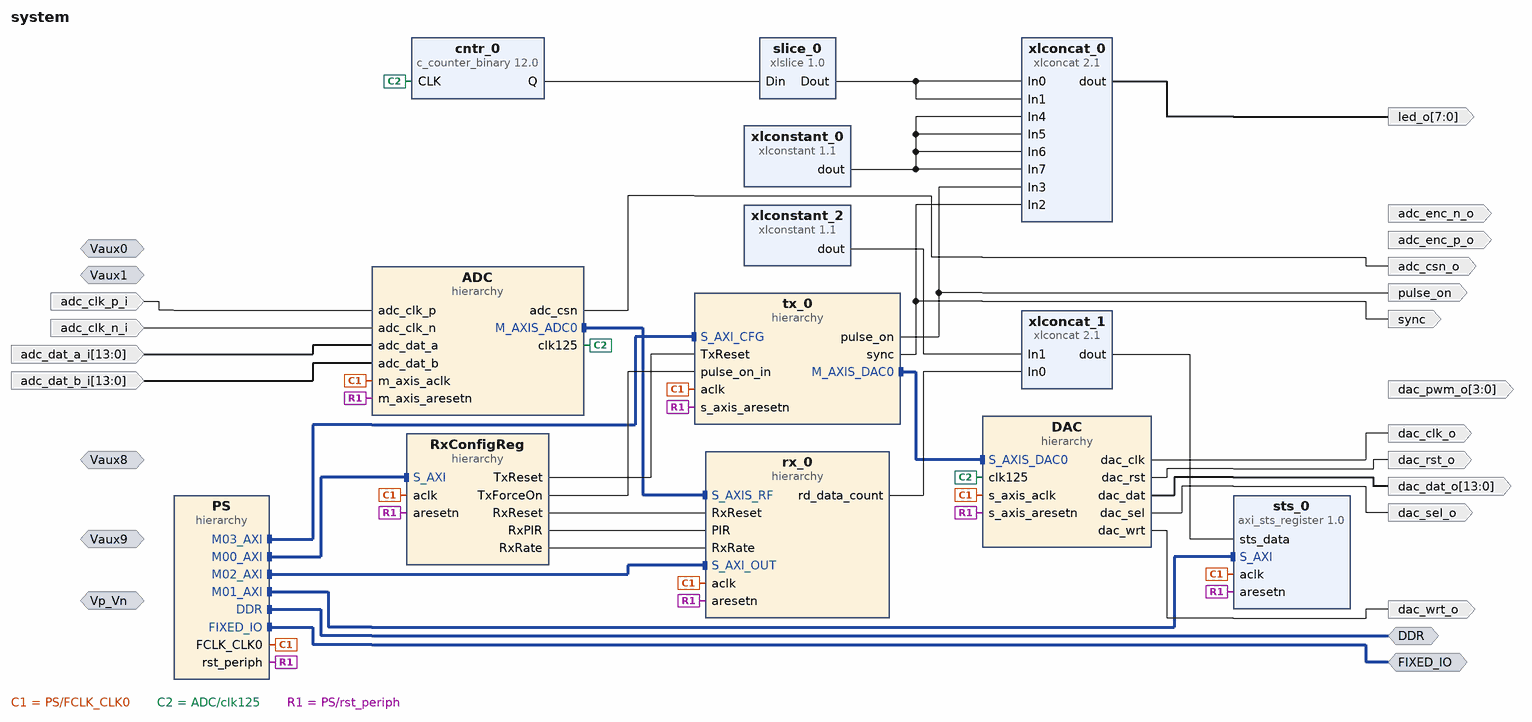
[diagram p0: block diagram of the top level]
# Vivado block design system, xc7z010clg400-1, Vivado 2016.3
create_bd_design system

create_bd_intf_port -mode Master -vlnv xilinx.com:interface:ddrx_rtl:1.0 DDR
create_bd_intf_port -mode Master -vlnv xilinx.com:display_processing_system7:fixedio_rtl:1.0 FIXED_IO
create_bd_intf_port -mode Slave -vlnv xilinx.com:interface:diff_analog_io_rtl:1.0 Vp_Vn
create_bd_intf_port -mode Slave -vlnv xilinx.com:interface:diff_analog_io_rtl:1.0 Vaux0
create_bd_intf_port -mode Slave -vlnv xilinx.com:interface:diff_analog_io_rtl:1.0 Vaux1
create_bd_intf_port -mode Slave -vlnv xilinx.com:interface:diff_analog_io_rtl:1.0 Vaux9
create_bd_intf_port -mode Slave -vlnv xilinx.com:interface:diff_analog_io_rtl:1.0 Vaux8
create_bd_port -dir O adc_enc_p_o
create_bd_port -dir O adc_enc_n_o
create_bd_port -dir O -from 3 -to 0 dac_pwm_o
create_bd_port -dir I adc_clk_p_i
create_bd_port -dir I adc_clk_n_i
create_bd_port -dir I -from 13 -to 0 adc_dat_a_i
create_bd_port -dir I -from 13 -to 0 adc_dat_b_i
create_bd_port -dir O adc_csn_o
create_bd_port -dir O dac_clk_o
create_bd_port -dir O dac_rst_o
create_bd_port -dir O dac_sel_o
create_bd_port -dir O dac_wrt_o
create_bd_port -dir O -from 13 -to 0 dac_dat_o
create_bd_port -dir O pulse_on
create_bd_port -dir O sync
create_bd_port -dir O -from 7 -to 0 led_o

create_bd_cell -type ip -vlnv xilinx.com:ip:xlslice:1.0 slice_0
set_property -dict {CONFIG.DOUT_WIDTH 1 CONFIG.DIN_TO 26 CONFIG.DIN_FROM 26 CONFIG.DIN_WIDTH 32} [get_bd_cells slice_0]
create_bd_cell -type hier rx_0
create_bd_cell -type hier tx_0
create_bd_cell -type ip -vlnv pavel-demin:user:axi_sts_register:1.0 sts_0
set_property -dict {CONFIG.STS_DATA_WIDTH 32 CONFIG.AXI_DATA_WIDTH 32 CONFIG.AXI_ADDR_WIDTH 32} [get_bd_cells sts_0]
create_bd_cell -type ip -vlnv xilinx.com:ip:c_counter_binary:12.0 cntr_0
set_property -dict {CONFIG.Output_Width 32} [get_bd_cells cntr_0]
create_bd_cell -type hier PS
create_bd_cell -type hier RxConfigReg
create_bd_cell -type ip -vlnv xilinx.com:ip:xlconcat:2.1 xlconcat_0
set_property -dict {CONFIG.NUM_PORTS 8} [get_bd_cells xlconcat_0]
create_bd_cell -type ip -vlnv xilinx.com:ip:xlconstant:1.1 xlconstant_0
create_bd_cell -type ip -vlnv xilinx.com:ip:xlconcat:2.1 xlconcat_1
set_property -dict {CONFIG.NUM_PORTS 2} [get_bd_cells xlconcat_1]
create_bd_cell -type ip -vlnv xilinx.com:ip:xlconstant:1.1 xlconstant_2
set_property -dict {CONFIG.CONST_WIDTH 17 CONFIG.CONST_VAL 0} [get_bd_cells xlconstant_2]
create_bd_cell -type hier DAC
create_bd_cell -type hier ADC

# ---- hierarchy /rx_0 ----
current_bd_instance /rx_0
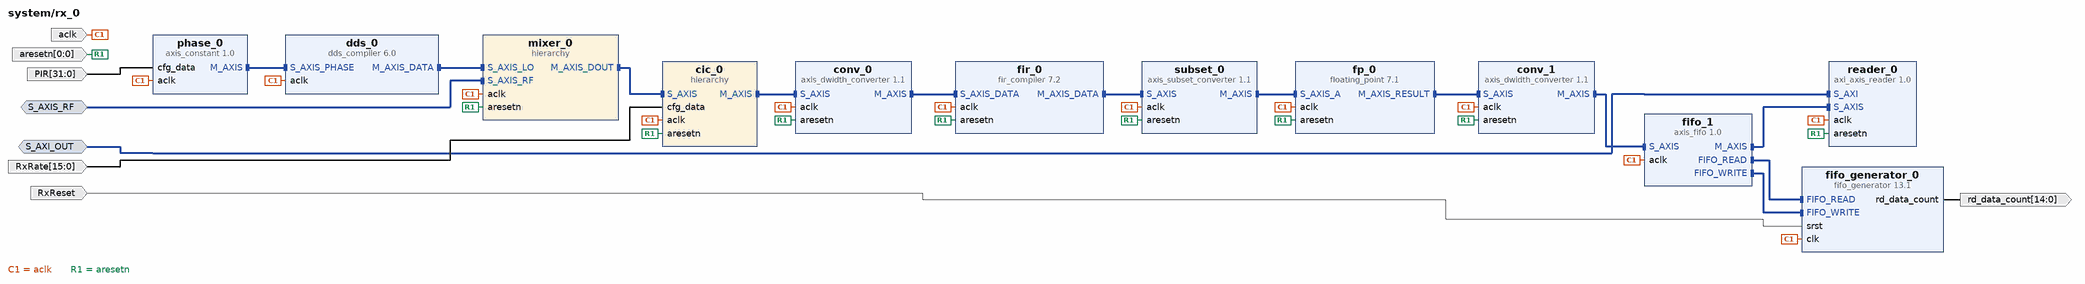
[diagram p1: block diagram inside /rx_0]
create_bd_intf_pin -mode Slave -vlnv xilinx.com:interface:aximm_rtl:1.0 S_AXI_OUT
create_bd_intf_pin -mode Slave -vlnv xilinx.com:interface:axis_rtl:1.0 S_AXIS_RF
create_bd_pin -dir I -type clk aclk
create_bd_pin -dir I -from 0 -to 0 -type rst aresetn
create_bd_pin -dir O -from 14 -to 0 rd_data_count
create_bd_pin -dir I RxReset
create_bd_pin -dir I -from 31 -to 0 PIR
create_bd_pin -dir I -from 15 -to 0 RxRate

create_bd_cell -type ip -vlnv pavel-demin:user:axis_constant:1.0 phase_0
set_property -dict {CONFIG.AXIS_TDATA_WIDTH 32} [get_bd_cells phase_0]
create_bd_cell -type ip -vlnv pavel-demin:user:axi_axis_reader:1.0 reader_0
set_property -dict {CONFIG.AXI_DATA_WIDTH 32} [get_bd_cells reader_0]
create_bd_cell -type ip -vlnv xilinx.com:ip:axis_dwidth_converter:1.1 conv_0
set_property -dict {CONFIG.S_TDATA_NUM_BYTES 6 CONFIG.M_TDATA_NUM_BYTES 3} [get_bd_cells conv_0]
create_bd_cell -type ip -vlnv xilinx.com:ip:axis_dwidth_converter:1.1 conv_1
set_property -dict {CONFIG.S_TDATA_NUM_BYTES 4 CONFIG.M_TDATA_NUM_BYTES 8} [get_bd_cells conv_1]
create_bd_cell -type ip -vlnv xilinx.com:ip:dds_compiler:6.0 dds_0
set_property -dict [list \
  CONFIG.DDS_Clock_Rate 125 \
  CONFIG.Spurious_Free_Dynamic_Range 138 \
  CONFIG.Frequency_Resolution 0.2 \
  CONFIG.Phase_Width 30 \
  CONFIG.Output_Width 24 \
  CONFIG.Phase_Increment Streaming \
  CONFIG.Negative_Sine false \
  CONFIG.DSP48_Use Minimal \
  CONFIG.Has_Phase_Out false \
  CONFIG.Has_TREADY true \
] [get_bd_cells dds_0]
create_bd_cell -type ip -vlnv xilinx.com:ip:fifo_generator:13.1 fifo_generator_0
set_property -dict [list \
  CONFIG.Performance_Options First_Word_Fall_Through \
  CONFIG.Input_Data_Width 64 \
  CONFIG.Input_Depth 8192 \
  CONFIG.Output_Data_Width 32 \
  CONFIG.Read_Data_Count true \
  CONFIG.Read_Data_Count_Width 15 \
] [get_bd_cells fifo_generator_0]
create_bd_cell -type ip -vlnv xilinx.com:ip:fir_compiler:7.2 fir_0
set_property -dict [list \
  CONFIG.CoefficientVector {-1.64767793258513e-08, -4.73130401933802e-08, -7.89015020514924e-10, 3.0928184365585e-08, 1.86171437967678e-08, 3.27417490308436e-08, -6.28882305952853e-09, -1.52249021913047e-07, -8.30430341770078e-08, 3.14471544812983e-07, 3.05585913883361e-07, -4.74074722314402e-07, -7.1338208245138e-07, 5.47206423115321e-07, 1.3343968996369e-06, -4.14040144583054e-07, -2.15013647398608e-06, -6.77619137550772e-08, 3.07492149792295e-06, 1.03687542811551e-06, -3.94365999515519e-06, -2.5914915826665e-06, 4.51456433189903e-06, 4.74702085282004e-06, -4.49203269648069e-06, -7.39696882784057e-06, 3.57151821825862e-06, 1.02877406394336e-05, -1.50354924265334e-06, -1.30185958926664e-05, -1.83174482827086e-06, 1.50755354383702e-05, 6.3534983589819e-06, -1.59029513110266e-05, -1.1730365587969e-05, 1.50084756841038e-05, 1.73688625150811e-05, -1.20923926627015e-05, -2.24628775241618e-05, 7.16873343279609e-06, 2.60986655918355e-05, -6.63803310616104e-07, -2.74245274524168e-05, -6.54903880761834e-06, 2.58600110513329e-05, 1.32014955436698e-05, -2.13136755611044e-05, -1.77863688020237e-05, 1.43644844800593e-05, 1.88158679557272e-05, -6.35743236236129e-06, -1.51594598941384e-05, -6.33340264439249e-07, 6.41449969049065e-06, 4.00578688109124e-06, 6.75621989783952e-06, -1.00377756449914e-06, -2.2398505461023e-05, -1.07621836546251e-05, 3.72258385282273e-05, 3.26964029837136e-05, -4.68508688937697e-05, -6.46423820481749e-05, 4.62500983625866e-05, 0.000104384232343877, -3.05330381601634e-05, -0.000147431561987664, -4.12147390650285e-06, 0.000187152827292834, 5.94637903355769e-05, -0.000215336486101329, -0.000134280163072923, 0.000223184095508548, 0.000223797283005097, -0.000202664167392007, -0.000319568481767237, 0.00014806955570149, 0.000409978966685005, -5.75495256781405e-05, -0.000481431007338046, -6.56642501833879e-05, 0.000520160554778501, 0.000212625552393526, -0.000514530090745051, -0.000368939171329215, 0.000457390149683129, 0.000515880947691506, -0.000348421662177339, -0.000632768442617035, 0.000195622490446342, 0.000700065348190713, -1.58057317708103e-05, -0.000703083728664529, -0.000166336378785249, 0.000635737406265774, 0.000320763687201459, -0.000503732017561133, -0.000416170022012877, 0.000326526970141958, 0.000425306548879864, -0.000137462265764282, -0.000330979941859231, -1.84048176671591e-05, 0.000131927647365226, 8.89478838287332e-05, 0.000152374873227341, -2.19722858559691e-05, -0.000479012308015841, -0.00022614865530981, 0.000781437457190653, 0.000680243238924177, -0.000973641121797422, -0.00133721680288367, 0.000957301297342088, 0.00215787191514504, -0.000632907257915351, -0.003061861827782, -8.63031823998107e-05, 0.00392679721544048, 0.0012587181051531, -0.00459238166585313, -0.00289858802427871, 0.00486993618945311, 0.00496186969403106, -0.00455706432107208, -0.00733540086522566, 0.00345654716644672, 0.00983082178384368, -0.0013979524281709, -0.0121840389988802, -0.00174001298838836, 0.0140598439849354, 0.00600743409066738, -0.015062994324315, -0.0113680773474374, 0.0147458915607562, 0.0176840463041863, -0.0126165251402871, -0.0247087717848408, 0.00812982134278691, 0.0320808592160365, -0.000645559420412108, -0.0393103467958045, -0.0106897859087942, 0.045729185206815, 0.0272443866466503, -0.0503139645101435, -0.0517055596247492, 0.0510135842875111, 0.0905541017267955, -0.0416082674314903, -0.163722176130542, -0.0107786376098801, 0.356376541271961, 0.554784695532231, 0.356376541271961, -0.0107786376098801, -0.163722176130542, -0.0416082674314903, 0.0905541017267954, 0.051013584287511, -0.0517055596247491, -0.0503139645101435, 0.0272443866466503, 0.045729185206815, -0.0106897859087943, -0.0393103467958045, -0.000645559420412102, 0.0320808592160365, 0.00812982134278688, -0.0247087717848408, -0.012616525140287, 0.0176840463041863, 0.0147458915607562, -0.0113680773474374, -0.0150629943243149, 0.00600743409066738, 0.0140598439849354, -0.00174001298838836, -0.0121840389988802, -0.0013979524281709, 0.00983082178384367, 0.00345654716644673, -0.00733540086522566, -0.00455706432107209, 0.00496186969403104, 0.00486993618945311, -0.00289858802427871, -0.00459238166585313, 0.0012587181051531, 0.00392679721544048, -8.63031823998206e-05, -0.003061861827782, -0.00063290725791536, 0.00215787191514504, 0.000957301297342091, -0.00133721680288367, -0.000973641121797417, 0.000680243238924181, 0.000781437457190653, -0.000226148655309812, -0.000479012308015826, -2.19722858559681e-05, 0.000152374873227327, 8.8947883828729e-05, 0.000131927647365228, -1.84048176671555e-05, -0.000330979941859234, -0.000137462265764287, 0.000425306548879865, 0.000326526970141962, -0.000416170022012868, -0.000503732017561137, 0.000320763687201449, 0.000635737406265777, -0.000166336378785242, -0.000703083728664529, -1.58057317708433e-05, 0.000700065348190713, 0.000195622490446357, -0.000632768442617035, -0.00034842166217735, 0.000515880947691503, 0.000457390149683133, -0.000368939171329213, -0.000514530090745054, 0.000212625552393524, 0.000520160554778502, -6.56642501833866e-05, -0.000481431007338041, -5.75495256781407e-05, 0.000409978966685006, 0.00014806955570149, -0.000319568481767233, -0.000202664167392008, 0.000223797283005097, 0.000223184095508547, -0.000134280163072924, -0.000215336486101328, 5.94637903355747e-05, 0.000187152827292833, -4.12147390650418e-06, -0.000147431561987664, -3.05330381601629e-05, 0.000104384232343877, 4.62500983625856e-05, -6.46423820481746e-05, -4.685086889377e-05, 3.26964029837137e-05, 3.72258385282232e-05, -1.0762183654625e-05, -2.23985054610212e-05, -1.00377756449925e-06, 6.75621989784024e-06, 4.00578688109135e-06, 6.41449969048969e-06, -6.3334026443941e-07, -1.51594598941391e-05, -6.35743236236115e-06, 1.88158679557273e-05, 1.43644844800593e-05, -1.77863688020233e-05, -2.13136755611043e-05, 1.32014955436695e-05, 2.58600110513327e-05, -6.54903880761725e-06, -2.74245274524168e-05, -6.63803310616344e-07, 2.60986655918356e-05, 7.16873343279648e-06, -2.24628775241617e-05, -1.20923926627015e-05, 1.7368862515081e-05, 1.50084756841038e-05, -1.1730365587969e-05, -1.59029513110268e-05, 6.35349835898202e-06, 1.50755354383701e-05, -1.8317448282709e-06, -1.30185958926663e-05, -1.50354924265335e-06, 1.02877406394342e-05, 3.57151821825862e-06, -7.39696882784057e-06, -4.49203269648073e-06, 4.74702085281997e-06, 4.51456433189905e-06, -2.59149158266642e-06, -3.94365999515521e-06, 1.03687542811548e-06, 3.07492149792293e-06, -6.7761913755078e-08, -2.15013647398607e-06, -4.14040144583041e-07, 1.33439689963689e-06, 5.47206423115316e-07, -7.13382082451387e-07, -4.74074722314374e-07, 3.05585913883357e-07, 3.14471544812957e-07, -8.30430341770035e-08, -1.52249021913042e-07, -6.28882305952705e-09, 3.27417490308378e-08, 1.86171437967661e-08, 3.09281843655902e-08, -7.89015020514364e-10, -4.73130401933756e-08, -1.64767793258518e-08} \
  CONFIG.Filter_Type Decimation \
  CONFIG.Decimation_Rate 2 \
  CONFIG.Number_Channels 2 \
  CONFIG.Number_Paths 1 \
  CONFIG.Sample_Frequency 5.0 \
  CONFIG.Clock_Frequency 125 \
  CONFIG.Quantization Quantize_Only \
  CONFIG.Coefficient_Width 24 \
  CONFIG.BestPrecision true \
  CONFIG.Data_Width 24 \
  CONFIG.Output_Rounding_Mode Convergent_Rounding_to_Even \
  CONFIG.Output_Width 25 \
  CONFIG.M_DATA_Has_TREADY true \
  CONFIG.Has_ARESETn true \
] [get_bd_cells fir_0]
create_bd_cell -type ip -vlnv xilinx.com:ip:floating_point:7.1 fp_0
set_property -dict [list \
  CONFIG.Operation_Type Fixed_to_float \
  CONFIG.A_Precision_Type Custom \
  CONFIG.C_A_Exponent_Width 1 \
  CONFIG.C_A_Fraction_Width 23 \
  CONFIG.Result_Precision_Type Single \
  CONFIG.C_Result_Exponent_Width 8 \
  CONFIG.C_Result_Fraction_Width 24 \
  CONFIG.C_Accum_Msb 32 \
  CONFIG.C_Accum_Lsb -1 \
  CONFIG.C_Accum_Input_Msb 0 \
  CONFIG.C_Mult_Usage No_Usage \
  CONFIG.C_Latency 7 \
  CONFIG.C_Rate 1 \
  CONFIG.Has_ARESETn true \
] [get_bd_cells fp_0]
create_bd_cell -type ip -vlnv xilinx.com:ip:axis_subset_converter:1.1 subset_0
set_property -dict [list \
  CONFIG.S_TDATA_NUM_BYTES 4 \
  CONFIG.M_TDATA_NUM_BYTES 3 \
  CONFIG.TDATA_REMAP {tdata[23:0]} \
] [get_bd_cells subset_0]
create_bd_cell -type hier cic_0
create_bd_cell -type hier mixer_0
create_bd_cell -type ip -vlnv pavel-demin:user:axis_fifo:1.0 fifo_1
set_property -dict {CONFIG.S_AXIS_TDATA_WIDTH 64 CONFIG.M_AXIS_TDATA_WIDTH 32} [get_bd_cells fifo_1]

# ---- hierarchy /rx_0/cic_0 ----
current_bd_instance /rx_0/cic_0
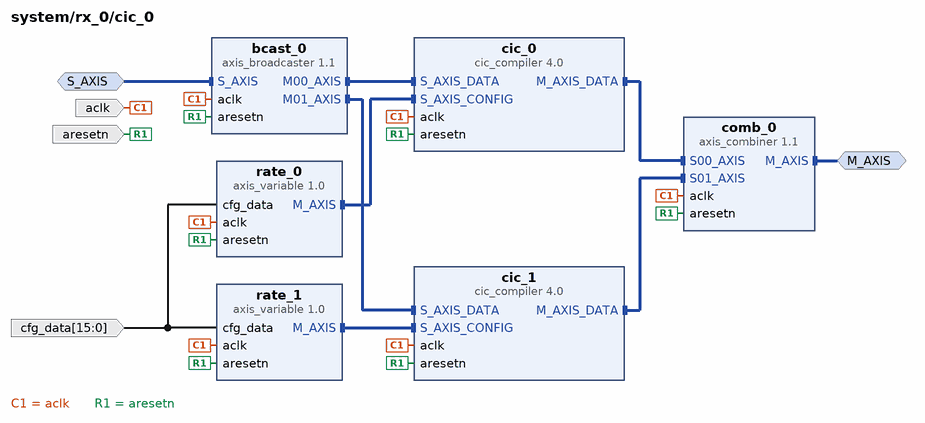
[diagram p2: block diagram inside /rx_0/cic_0]
create_bd_intf_pin -mode Slave -vlnv xilinx.com:interface:axis_rtl:1.0 S_AXIS
create_bd_intf_pin -mode Master -vlnv xilinx.com:interface:axis_rtl:1.0 M_AXIS
create_bd_pin -dir I -type clk aclk
create_bd_pin -dir I -type rst aresetn
create_bd_pin -dir I -from 15 -to 0 cfg_data

create_bd_cell -type ip -vlnv xilinx.com:ip:axis_broadcaster:1.1 bcast_0
set_property -dict [list \
  CONFIG.M_TDATA_NUM_BYTES 3 \
  CONFIG.S_TDATA_NUM_BYTES 8 \
  CONFIG.M00_TDATA_REMAP {tdata[23:0]} \
  CONFIG.M01_TDATA_REMAP {tdata[55:32]} \
] [get_bd_cells bcast_0]
create_bd_cell -type ip -vlnv xilinx.com:ip:cic_compiler:4.0 cic_0
set_property -dict [list \
  CONFIG.Filter_Type Decimation \
  CONFIG.Number_Of_Stages 6 \
  CONFIG.Sample_Rate_Changes Programmable \
  CONFIG.Fixed_Or_Initial_Rate 625 \
  CONFIG.Minimum_Rate 25 \
  CONFIG.Maximum_Rate 8192 \
  CONFIG.Input_Sample_Frequency 125 \
  CONFIG.Clock_Frequency 125 \
  CONFIG.Input_Data_Width 24 \
  CONFIG.Quantization Truncation \
  CONFIG.Output_Data_Width 24 \
  CONFIG.Use_Xtreme_DSP_Slice false \
  CONFIG.HAS_ARESETN true \
  CONFIG.HAS_DOUT_TREADY true \
] [get_bd_cells cic_0]
create_bd_cell -type ip -vlnv xilinx.com:ip:cic_compiler:4.0 cic_1
set_property -dict [list \
  CONFIG.Filter_Type Decimation \
  CONFIG.Number_Of_Stages 6 \
  CONFIG.Sample_Rate_Changes Programmable \
  CONFIG.Fixed_Or_Initial_Rate 625 \
  CONFIG.Minimum_Rate 25 \
  CONFIG.Maximum_Rate 8192 \
  CONFIG.Input_Sample_Frequency 125 \
  CONFIG.Clock_Frequency 125 \
  CONFIG.Input_Data_Width 24 \
  CONFIG.Quantization Truncation \
  CONFIG.Output_Data_Width 24 \
  CONFIG.Use_Xtreme_DSP_Slice false \
  CONFIG.HAS_ARESETN true \
  CONFIG.HAS_DOUT_TREADY true \
] [get_bd_cells cic_1]
create_bd_cell -type ip -vlnv xilinx.com:ip:axis_combiner:1.1 comb_0
set_property -dict {CONFIG.TDATA_NUM_BYTES 3} [get_bd_cells comb_0]
create_bd_cell -type ip -vlnv pavel-demin:user:axis_variable:1.0 rate_1
set_property -dict {CONFIG.AXIS_TDATA_WIDTH 16} [get_bd_cells rate_1]
create_bd_cell -type ip -vlnv pavel-demin:user:axis_variable:1.0 rate_0
set_property -dict {CONFIG.AXIS_TDATA_WIDTH 16} [get_bd_cells rate_0]

# ---- hierarchy /rx_0/mixer_0 ----
current_bd_instance /rx_0/mixer_0
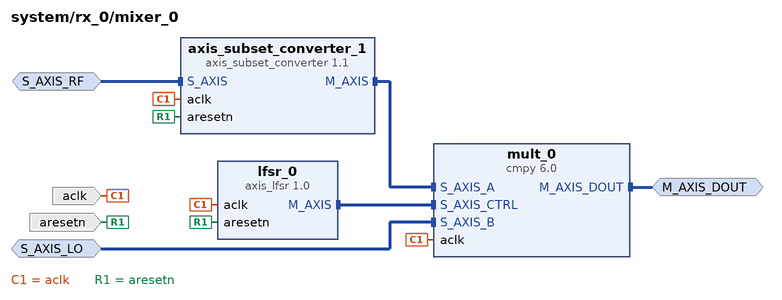
[diagram p3: block diagram inside /rx_0/mixer_0]
create_bd_intf_pin -mode Master -vlnv xilinx.com:interface:axis_rtl:1.0 M_AXIS_DOUT
create_bd_intf_pin -mode Slave -vlnv xilinx.com:interface:axis_rtl:1.0 S_AXIS_RF
create_bd_intf_pin -mode Slave -vlnv xilinx.com:interface:axis_rtl:1.0 S_AXIS_LO
create_bd_pin -dir I -type clk aclk
create_bd_pin -dir I -type rst aresetn

create_bd_cell -type ip -vlnv xilinx.com:ip:cmpy:6.0 mult_0
set_property -dict [list \
  CONFIG.APortWidth 14 \
  CONFIG.BPortWidth 24 \
  CONFIG.FlowControl Blocking \
  CONFIG.RoundMode Random_Rounding \
  CONFIG.OutputWidth 25 \
] [get_bd_cells mult_0]
create_bd_cell -type ip -vlnv pavel-demin:user:axis_lfsr:1.0 lfsr_0
set_property -dict {CONFIG.AXIS_TDATA_WIDTH 8} [get_bd_cells lfsr_0]
create_bd_cell -type ip -vlnv xilinx.com:ip:axis_subset_converter:1.1 axis_subset_converter_1
set_property -dict [list \
  CONFIG.S_TDATA_NUM_BYTES 2 \
  CONFIG.M_TDATA_NUM_BYTES 4 \
  CONFIG.TDATA_REMAP {16'b0000000000000000,tdata[15:0]} \
] [get_bd_cells axis_subset_converter_1]

# ---- hierarchy /tx_0 ----
current_bd_instance /tx_0
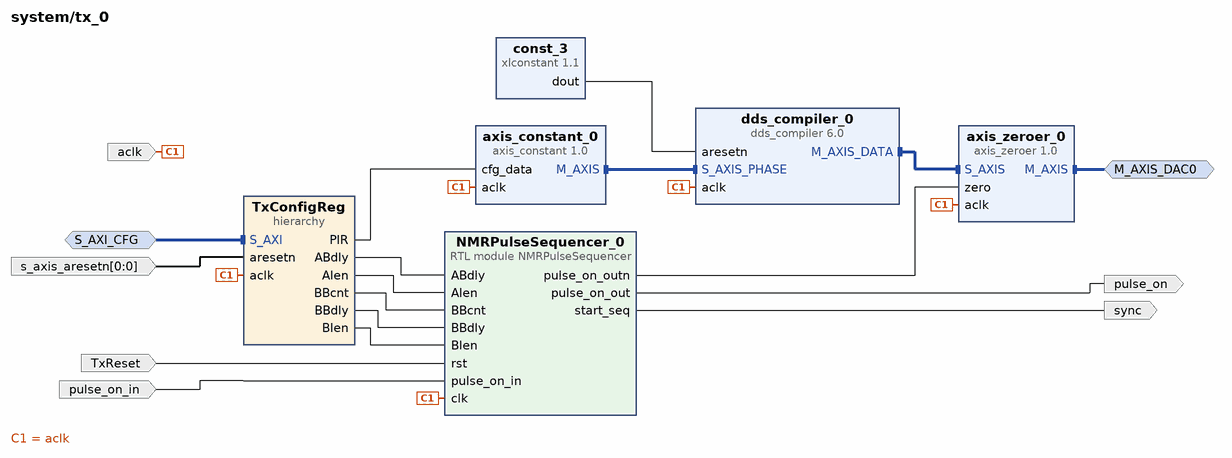
[diagram p4: block diagram inside /tx_0]
create_bd_intf_pin -mode Slave -vlnv xilinx.com:interface:aximm_rtl:1.0 S_AXI_CFG
create_bd_intf_pin -mode Master -vlnv xilinx.com:interface:axis_rtl:1.0 M_AXIS_DAC0
create_bd_pin -dir I -type clk aclk
create_bd_pin -dir I -from 0 -to 0 -type rst s_axis_aresetn
create_bd_pin -dir I -type rst TxReset
create_bd_pin -dir O pulse_on
create_bd_pin -dir O sync
create_bd_pin -dir I pulse_on_in

create_bd_cell -type ip -vlnv pavel-demin:user:axis_constant:1.0 axis_constant_0
set_property -dict {CONFIG.AXIS_TDATA_WIDTH 32} [get_bd_cells axis_constant_0]
create_bd_cell -type ip -vlnv xilinx.com:ip:dds_compiler:6.0 dds_compiler_0
set_property -dict [list \
  CONFIG.PartsPresent Phase_Generator_and_SIN_COS_LUT \
  CONFIG.DDS_Clock_Rate 125 \
  CONFIG.Parameter_Entry Hardware_Parameters \
  CONFIG.Spurious_Free_Dynamic_Range 138 \
  CONFIG.Frequency_Resolution 0.2 \
  CONFIG.Noise_Shaping Taylor_Series_Corrected \
  CONFIG.Phase_Width 30 \
  CONFIG.Output_Width 14 \
  CONFIG.Phase_Increment Streaming \
  CONFIG.Resync false \
  CONFIG.Output_Selection Sine \
  CONFIG.Negative_Sine false \
  CONFIG.Has_Phase_Out false \
  CONFIG.DATA_Has_TLAST Not_Required \
  CONFIG.Has_TREADY true \
  CONFIG.S_PHASE_Has_TUSER Not_Required \
  CONFIG.M_DATA_Has_TUSER Not_Required \
  CONFIG.M_PHASE_Has_TUSER Not_Required \
  CONFIG.Latency_Configuration Auto \
  CONFIG.Latency 14 \
  CONFIG.Has_ARESETn true \
  CONFIG.Has_ACLKEN false \
  CONFIG.Output_Frequency1 0 \
  CONFIG.PINC1 0 \
] [get_bd_cells dds_compiler_0]
create_bd_cell -type hier TxConfigReg
create_bd_cell -type ip -vlnv xilinx.com:ip:xlconstant:1.1 const_3
create_bd_cell -type ip -vlnv pavel-demin:user:axis_zeroer:1.0 axis_zeroer_0
set_property -dict {CONFIG.AXIS_TDATA_WIDTH 16} [get_bd_cells axis_zeroer_0]
create_bd_cell -type module -reference NMRPulseSequencer NMRPulseSequencer_0
set_property -dict {CONFIG.US_DIVIDER 143} [get_bd_cells NMRPulseSequencer_0]

# ---- hierarchy /tx_0/TxConfigReg ----
current_bd_instance /tx_0/TxConfigReg
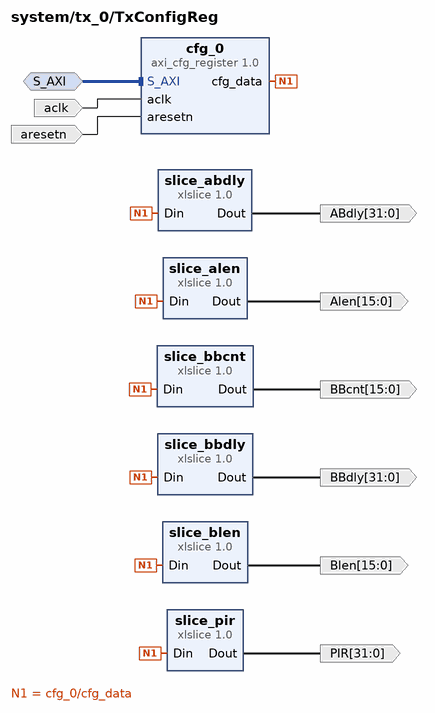
[diagram p5: block diagram inside /tx_0/TxConfigReg]
create_bd_intf_pin -mode Slave -vlnv xilinx.com:interface:aximm_rtl:1.0 S_AXI
create_bd_pin -dir O -from 31 -to 0 PIR
create_bd_pin -dir I -type clk aclk
create_bd_pin -dir I -type rst aresetn
create_bd_pin -dir O -from 31 -to 0 ABdly
create_bd_pin -dir O -from 15 -to 0 Alen
create_bd_pin -dir O -from 15 -to 0 BBcnt
create_bd_pin -dir O -from 31 -to 0 BBdly
create_bd_pin -dir O -from 15 -to 0 Blen

create_bd_cell -type ip -vlnv xilinx.com:ip:xlslice:1.0 slice_pir
set_property -dict {CONFIG.DOUT_WIDTH 32 CONFIG.DIN_TO 0 CONFIG.DIN_FROM 31 CONFIG.DIN_WIDTH 160} [get_bd_cells slice_pir]
create_bd_cell -type ip -vlnv xilinx.com:ip:xlslice:1.0 slice_alen
set_property -dict {CONFIG.DOUT_WIDTH 16 CONFIG.DIN_TO 32 CONFIG.DIN_FROM 47 CONFIG.DIN_WIDTH 160} [get_bd_cells slice_alen]
create_bd_cell -type ip -vlnv xilinx.com:ip:xlslice:1.0 slice_blen
set_property -dict {CONFIG.DOUT_WIDTH 16 CONFIG.DIN_TO 48 CONFIG.DIN_FROM 63 CONFIG.DIN_WIDTH 160} [get_bd_cells slice_blen]
create_bd_cell -type ip -vlnv xilinx.com:ip:xlslice:1.0 slice_abdly
set_property -dict {CONFIG.DOUT_WIDTH 32 CONFIG.DIN_TO 64 CONFIG.DIN_FROM 95 CONFIG.DIN_WIDTH 160} [get_bd_cells slice_abdly]
create_bd_cell -type ip -vlnv xilinx.com:ip:xlslice:1.0 slice_bbdly
set_property -dict {CONFIG.DOUT_WIDTH 32 CONFIG.DIN_TO 96 CONFIG.DIN_FROM 127 CONFIG.DIN_WIDTH 160} [get_bd_cells slice_bbdly]
create_bd_cell -type ip -vlnv pavel-demin:user:axi_cfg_register:1.0 cfg_0
set_property -dict {CONFIG.CFG_DATA_WIDTH 160 CONFIG.AXI_DATA_WIDTH 32 CONFIG.AXI_ADDR_WIDTH 32} [get_bd_cells cfg_0]
create_bd_cell -type ip -vlnv xilinx.com:ip:xlslice:1.0 slice_bbcnt
set_property -dict {CONFIG.DOUT_WIDTH 16 CONFIG.DIN_TO 128 CONFIG.DIN_FROM 143 CONFIG.DIN_WIDTH 160} [get_bd_cells slice_bbcnt]

# ---- hierarchy /PS ----
current_bd_instance /PS
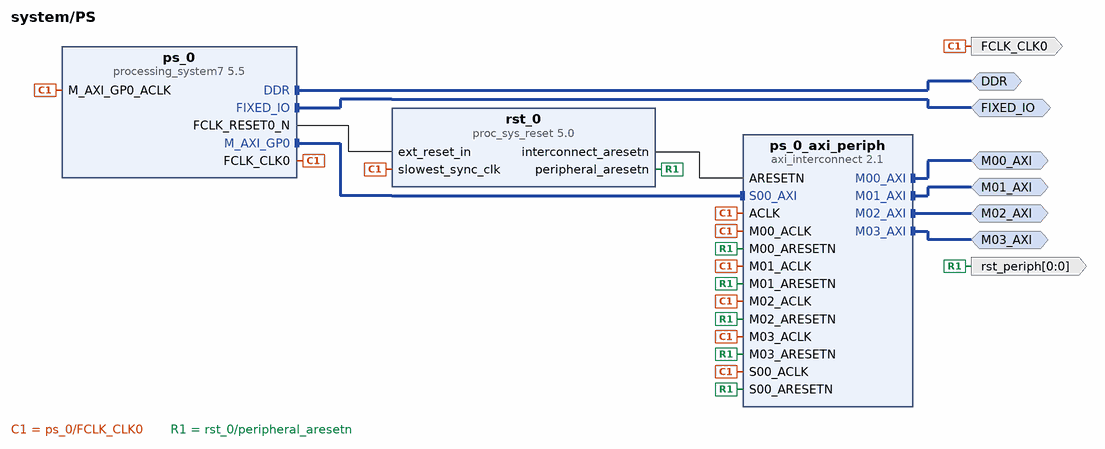
[diagram p6: block diagram inside /PS]
create_bd_intf_pin -mode Master -vlnv xilinx.com:interface:ddrx_rtl:1.0 DDR
create_bd_intf_pin -mode Master -vlnv xilinx.com:display_processing_system7:fixedio_rtl:1.0 FIXED_IO
create_bd_intf_pin -mode Master -vlnv xilinx.com:interface:aximm_rtl:1.0 M00_AXI
create_bd_intf_pin -mode Master -vlnv xilinx.com:interface:aximm_rtl:1.0 M01_AXI
create_bd_intf_pin -mode Master -vlnv xilinx.com:interface:aximm_rtl:1.0 M02_AXI
create_bd_intf_pin -mode Master -vlnv xilinx.com:interface:aximm_rtl:1.0 M03_AXI
create_bd_pin -dir O -type clk FCLK_CLK0
create_bd_pin -dir O -from 0 -to 0 -type rst rst_periph

create_bd_cell -type ip -vlnv xilinx.com:ip:proc_sys_reset:5.0 rst_0
create_bd_cell -type ip -vlnv xilinx.com:ip:processing_system7:5.5 ps_0
set_property -dict {CONFIG.PCW_IMPORT_BOARD_PRESET cfg/red_pitaya.xml} [get_bd_cells ps_0]
create_bd_cell -type ip -vlnv xilinx.com:ip:axi_interconnect:2.1 ps_0_axi_periph
set_property -dict {CONFIG.NUM_MI 4} [get_bd_cells ps_0_axi_periph]

# ---- hierarchy /RxConfigReg ----
current_bd_instance /RxConfigReg
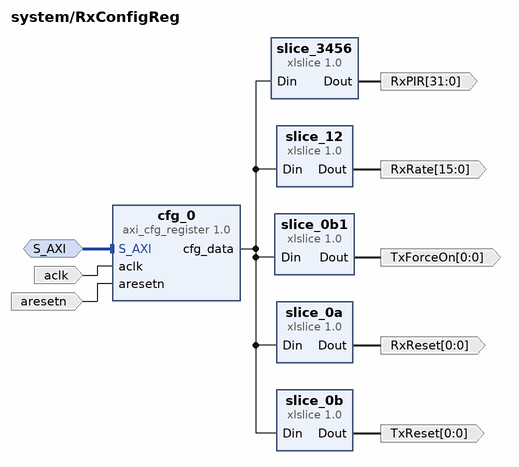
[diagram p7: block diagram inside /RxConfigReg]
create_bd_intf_pin -mode Slave -vlnv xilinx.com:interface:aximm_rtl:1.0 S_AXI
create_bd_pin -dir I -type clk aclk
create_bd_pin -dir I -type rst aresetn
create_bd_pin -dir O -from 0 -to 0 -type rst TxReset
create_bd_pin -dir O -from 0 -to 0 RxReset
create_bd_pin -dir O -from 31 -to 0 RxPIR
create_bd_pin -dir O -from 15 -to 0 RxRate
create_bd_pin -dir O -from 0 -to 0 TxForceOn

create_bd_cell -type ip -vlnv pavel-demin:user:axi_cfg_register:1.0 cfg_0
set_property -dict {CONFIG.CFG_DATA_WIDTH 128 CONFIG.AXI_DATA_WIDTH 32 CONFIG.AXI_ADDR_WIDTH 32} [get_bd_cells cfg_0]
create_bd_cell -type ip -vlnv xilinx.com:ip:xlslice:1.0 slice_0b
set_property -dict {CONFIG.DOUT_WIDTH 1 CONFIG.DIN_TO 1 CONFIG.DIN_FROM 1 CONFIG.DIN_WIDTH 128} [get_bd_cells slice_0b]
create_bd_cell -type ip -vlnv xilinx.com:ip:xlslice:1.0 slice_0a
set_property -dict {CONFIG.DOUT_WIDTH 1 CONFIG.DIN_TO 0 CONFIG.DIN_FROM 0 CONFIG.DIN_WIDTH 128} [get_bd_cells slice_0a]
create_bd_cell -type ip -vlnv xilinx.com:ip:xlslice:1.0 slice_3456
set_property -dict {CONFIG.DOUT_WIDTH 32 CONFIG.DIN_TO 32 CONFIG.DIN_FROM 63 CONFIG.DIN_WIDTH 128} [get_bd_cells slice_3456]
create_bd_cell -type ip -vlnv xilinx.com:ip:xlslice:1.0 slice_12
set_property -dict {CONFIG.DOUT_WIDTH 16 CONFIG.DIN_TO 16 CONFIG.DIN_FROM 31 CONFIG.DIN_WIDTH 128} [get_bd_cells slice_12]
create_bd_cell -type ip -vlnv xilinx.com:ip:xlslice:1.0 slice_0b1
set_property -dict {CONFIG.DOUT_WIDTH 1 CONFIG.DIN_TO 7 CONFIG.DIN_FROM 7 CONFIG.DIN_WIDTH 128} [get_bd_cells slice_0b1]

# ---- hierarchy /DAC ----
current_bd_instance /DAC
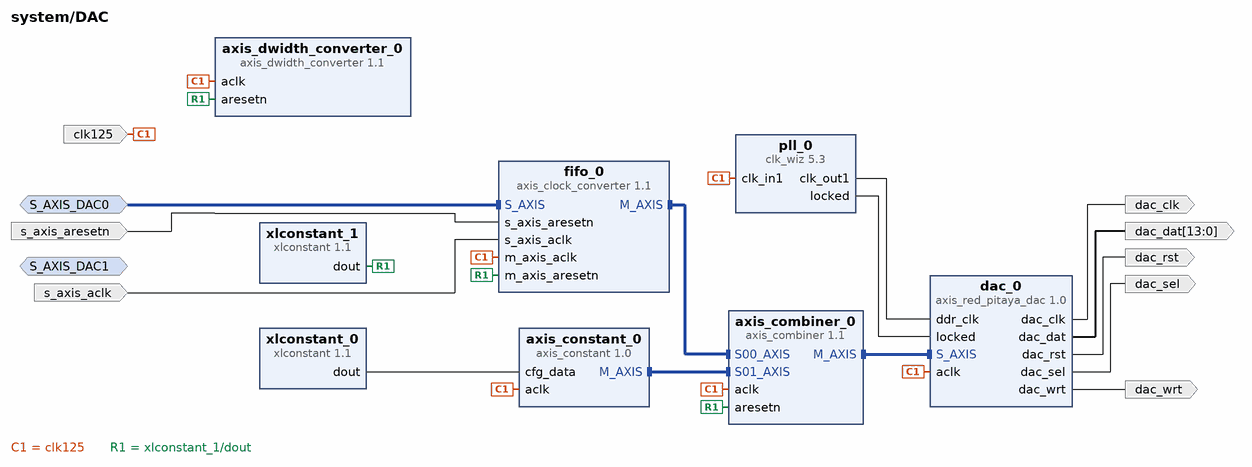
[diagram p8: block diagram inside /DAC]
create_bd_intf_pin -mode Slave -vlnv xilinx.com:interface:axis_rtl:1.0 S_AXIS_DAC0
create_bd_intf_pin -mode Slave -vlnv xilinx.com:interface:axis_rtl:1.0 S_AXIS_DAC1
create_bd_pin -dir I -type clk clk125
create_bd_pin -dir I -type rst s_axis_aresetn
create_bd_pin -dir I -type clk s_axis_aclk
create_bd_pin -dir O -type clk dac_clk
create_bd_pin -dir O -type rst dac_rst
create_bd_pin -dir O dac_sel
create_bd_pin -dir O dac_wrt
create_bd_pin -dir O -from 13 -to 0 dac_dat

create_bd_cell -type ip -vlnv xilinx.com:ip:clk_wiz:5.3 pll_0
set_property -dict [list \
  CONFIG.PRIM_IN_FREQ 125.0 \
  CONFIG.CLKOUT1_USED true \
  CONFIG.CLKOUT1_REQUESTED_OUT_FREQ 250.0 \
  CONFIG.USE_RESET false \
] [get_bd_cells pll_0]
create_bd_cell -type ip -vlnv pavel-demin:user:axis_constant:1.0 axis_constant_0
set_property -dict {CONFIG.AXIS_TDATA_WIDTH 16} [get_bd_cells axis_constant_0]
create_bd_cell -type ip -vlnv xilinx.com:ip:axis_clock_converter:1.1 fifo_0
set_property -dict {CONFIG.TDATA_NUM_BYTES 2} [get_bd_cells fifo_0]
create_bd_cell -type ip -vlnv xilinx.com:ip:axis_dwidth_converter:1.1 axis_dwidth_converter_0
set_property -dict {CONFIG.S_TDATA_NUM_BYTES 2 CONFIG.M_TDATA_NUM_BYTES 4} [get_bd_cells axis_dwidth_converter_0]
create_bd_cell -type ip -vlnv xilinx.com:ip:axis_combiner:1.1 axis_combiner_0
set_property -dict {CONFIG.TDATA_NUM_BYTES 2} [get_bd_cells axis_combiner_0]
create_bd_cell -type ip -vlnv pavel-demin:user:axis_red_pitaya_dac:1.0 dac_0
create_bd_cell -type ip -vlnv xilinx.com:ip:xlconstant:1.1 xlconstant_1
create_bd_cell -type ip -vlnv xilinx.com:ip:xlconstant:1.1 xlconstant_0
set_property -dict {CONFIG.CONST_WIDTH 16 CONFIG.CONST_VAL 0} [get_bd_cells xlconstant_0]

# ---- hierarchy /ADC ----
current_bd_instance /ADC
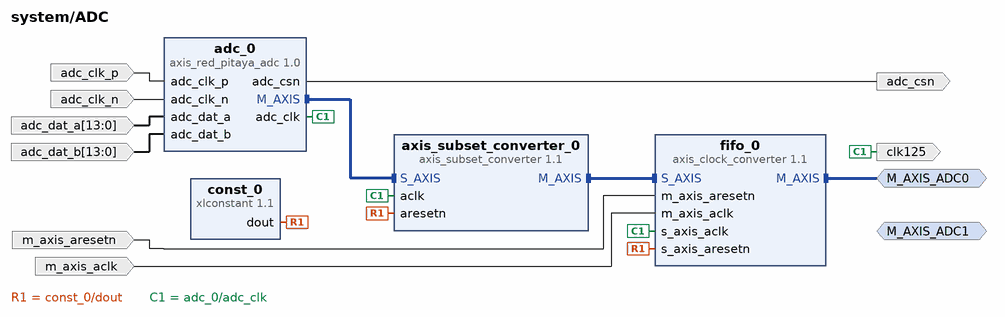
[diagram p9: block diagram inside /ADC]
create_bd_intf_pin -mode Master -vlnv xilinx.com:interface:axis_rtl:1.0 M_AXIS_ADC0
create_bd_intf_pin -mode Master -vlnv xilinx.com:interface:axis_rtl:1.0 M_AXIS_ADC1
create_bd_pin -dir O -type clk clk125
create_bd_pin -dir O adc_csn
create_bd_pin -dir I -type clk adc_clk_p
create_bd_pin -dir I -type clk adc_clk_n
create_bd_pin -dir I -from 13 -to 0 adc_dat_a
create_bd_pin -dir I -from 13 -to 0 adc_dat_b
create_bd_pin -dir I -type rst m_axis_aresetn
create_bd_pin -dir I -type clk m_axis_aclk

create_bd_cell -type ip -vlnv pavel-demin:user:axis_red_pitaya_adc:1.0 adc_0
create_bd_cell -type ip -vlnv xilinx.com:ip:xlconstant:1.1 const_0
create_bd_cell -type ip -vlnv xilinx.com:ip:axis_clock_converter:1.1 fifo_0
set_property -dict {CONFIG.TDATA_NUM_BYTES 2} [get_bd_cells fifo_0]
create_bd_cell -type ip -vlnv xilinx.com:ip:axis_subset_converter:1.1 axis_subset_converter_0
set_property -dict [list \
  CONFIG.S_TDATA_NUM_BYTES 4 \
  CONFIG.M_TDATA_NUM_BYTES 2 \
  CONFIG.TDATA_REMAP {tdata[15:0]} \
] [get_bd_cells axis_subset_converter_0]

# ---- connections ----

current_bd_instance /rx_0
connect_bd_intf_net [get_bd_intf_pins dds_0/S_AXIS_PHASE] [get_bd_intf_pins phase_0/M_AXIS]
connect_bd_intf_net [get_bd_intf_pins cic_0/S_AXIS] [get_bd_intf_pins mixer_0/M_AXIS_DOUT]
connect_bd_intf_net [get_bd_intf_pins conv_0/S_AXIS] [get_bd_intf_pins cic_0/M_AXIS]
connect_bd_intf_net [get_bd_intf_pins subset_0/S_AXIS] [get_bd_intf_pins fir_0/M_AXIS_DATA]
connect_bd_intf_net [get_bd_intf_pins conv_1/S_AXIS] [get_bd_intf_pins fp_0/M_AXIS_RESULT]
connect_bd_intf_net [get_bd_intf_pins fifo_1/S_AXIS] [get_bd_intf_pins conv_1/M_AXIS]
connect_bd_intf_net [get_bd_intf_pins fifo_1/FIFO_READ] [get_bd_intf_pins fifo_generator_0/FIFO_READ]
connect_bd_intf_net [get_bd_intf_pins fifo_1/FIFO_WRITE] [get_bd_intf_pins fifo_generator_0/FIFO_WRITE]
connect_bd_intf_net [get_bd_intf_pins reader_0/S_AXIS] [get_bd_intf_pins fifo_1/M_AXIS]
connect_bd_intf_net [get_bd_intf_pins conv_0/M_AXIS] [get_bd_intf_pins fir_0/S_AXIS_DATA]
connect_bd_intf_net [get_bd_intf_pins subset_0/M_AXIS] [get_bd_intf_pins fp_0/S_AXIS_A]
connect_bd_intf_net [get_bd_intf_pins dds_0/M_AXIS_DATA] [get_bd_intf_pins mixer_0/S_AXIS_LO]
connect_bd_intf_net [get_bd_intf_pins S_AXI_OUT] [get_bd_intf_pins reader_0/S_AXI]
connect_bd_intf_net [get_bd_intf_pins S_AXIS_RF] [get_bd_intf_pins mixer_0/S_AXIS_RF]
connect_bd_net -net m_axis_aclk_1 [get_bd_pins aclk] \
  [get_bd_pins phase_0/aclk] [get_bd_pins reader_0/aclk] [get_bd_pins conv_0/aclk] [get_bd_pins conv_1/aclk] \
  [get_bd_pins dds_0/aclk] [get_bd_pins fifo_generator_0/clk] [get_bd_pins fir_0/aclk] [get_bd_pins fp_0/aclk] \
  [get_bd_pins subset_0/aclk] [get_bd_pins fifo_1/aclk] [get_bd_pins cic_0/aclk] [get_bd_pins mixer_0/aclk]
connect_bd_net -net m_axis_aresetn_1 [get_bd_pins aresetn] \
  [get_bd_pins reader_0/aresetn] [get_bd_pins conv_0/aresetn] [get_bd_pins conv_1/aresetn] [get_bd_pins fir_0/aresetn] \
  [get_bd_pins fp_0/aresetn] [get_bd_pins subset_0/aresetn] [get_bd_pins cic_0/aresetn] [get_bd_pins mixer_0/aresetn]
connect_bd_net -net slice_2_Dout [get_bd_pins RxRate] [get_bd_pins cic_0/cfg_data]
connect_bd_net [get_bd_pins fifo_generator_0/rd_data_count] [get_bd_pins rd_data_count]
connect_bd_net -net srst_1 [get_bd_pins RxReset] [get_bd_pins fifo_generator_0/srst]
connect_bd_net -net cfg_data_1 [get_bd_pins PIR] [get_bd_pins phase_0/cfg_data]

current_bd_instance /rx_0/cic_0
connect_bd_intf_net [get_bd_intf_pins cic_0/S_AXIS_DATA] [get_bd_intf_pins bcast_0/M00_AXIS]
connect_bd_intf_net [get_bd_intf_pins cic_1/S_AXIS_DATA] [get_bd_intf_pins bcast_0/M01_AXIS]
connect_bd_intf_net [get_bd_intf_pins cic_1/S_AXIS_CONFIG] [get_bd_intf_pins rate_1/M_AXIS]
connect_bd_intf_net [get_bd_intf_pins cic_0/S_AXIS_CONFIG] [get_bd_intf_pins rate_0/M_AXIS]
connect_bd_intf_net [get_bd_intf_pins cic_0/M_AXIS_DATA] [get_bd_intf_pins comb_0/S00_AXIS]
connect_bd_intf_net [get_bd_intf_pins comb_0/S01_AXIS] [get_bd_intf_pins cic_1/M_AXIS_DATA]
connect_bd_intf_net [get_bd_intf_pins S_AXIS] [get_bd_intf_pins bcast_0/S_AXIS]
connect_bd_intf_net [get_bd_intf_pins M_AXIS] [get_bd_intf_pins comb_0/M_AXIS]
connect_bd_net -net m_axis_aclk_1 [get_bd_pins aclk] \
  [get_bd_pins cic_0/aclk] [get_bd_pins cic_1/aclk] [get_bd_pins comb_0/aclk] [get_bd_pins bcast_0/aclk] \
  [get_bd_pins rate_1/aclk] [get_bd_pins rate_0/aclk]
connect_bd_net -net m_axis_aresetn_1 [get_bd_pins aresetn] \
  [get_bd_pins cic_0/aresetn] [get_bd_pins cic_1/aresetn] [get_bd_pins comb_0/aresetn] [get_bd_pins bcast_0/aresetn] \
  [get_bd_pins rate_1/aresetn] [get_bd_pins rate_0/aresetn]
connect_bd_net [get_bd_pins cfg_data] [get_bd_pins rate_1/cfg_data] [get_bd_pins rate_0/cfg_data]

current_bd_instance /rx_0/mixer_0
connect_bd_intf_net [get_bd_intf_pins axis_subset_converter_1/M_AXIS] [get_bd_intf_pins mult_0/S_AXIS_A]
connect_bd_intf_net [get_bd_intf_pins lfsr_0/M_AXIS] [get_bd_intf_pins mult_0/S_AXIS_CTRL]
connect_bd_intf_net [get_bd_intf_pins M_AXIS_DOUT] [get_bd_intf_pins mult_0/M_AXIS_DOUT]
connect_bd_intf_net [get_bd_intf_pins S_AXIS_RF] [get_bd_intf_pins axis_subset_converter_1/S_AXIS]
connect_bd_intf_net [get_bd_intf_pins S_AXIS_LO] [get_bd_intf_pins mult_0/S_AXIS_B]
connect_bd_net -net m_axis_aclk_1 [get_bd_pins aclk] [get_bd_pins mult_0/aclk] [get_bd_pins lfsr_0/aclk] [get_bd_pins axis_subset_converter_1/aclk]
connect_bd_net -net m_axis_aresetn_1 [get_bd_pins aresetn] [get_bd_pins lfsr_0/aresetn] [get_bd_pins axis_subset_converter_1/aresetn]

current_bd_instance /tx_0
connect_bd_intf_net [get_bd_intf_pins axis_constant_0/M_AXIS] [get_bd_intf_pins dds_compiler_0/S_AXIS_PHASE]
connect_bd_intf_net [get_bd_intf_pins dds_compiler_0/M_AXIS_DATA] [get_bd_intf_pins axis_zeroer_0/S_AXIS]
connect_bd_intf_net [get_bd_intf_pins S_AXI_CFG] [get_bd_intf_pins TxConfigReg/S_AXI]
connect_bd_intf_net [get_bd_intf_pins M_AXIS_DAC0] [get_bd_intf_pins axis_zeroer_0/M_AXIS]
connect_bd_net [get_bd_pins aclk] \
  [get_bd_pins axis_constant_0/aclk] [get_bd_pins dds_compiler_0/aclk] [get_bd_pins axis_zeroer_0/aclk] \
  [get_bd_pins NMRPulseSequencer_0/clk] [get_bd_pins TxConfigReg/aclk]
connect_bd_net [get_bd_pins s_axis_aresetn] [get_bd_pins TxConfigReg/aresetn]
connect_bd_net [get_bd_pins TxConfigReg/ABdly] [get_bd_pins NMRPulseSequencer_0/ABdly]
connect_bd_net [get_bd_pins TxConfigReg/Alen] [get_bd_pins NMRPulseSequencer_0/Alen]
connect_bd_net [get_bd_pins TxConfigReg/BBcnt] [get_bd_pins NMRPulseSequencer_0/BBcnt]
connect_bd_net [get_bd_pins TxConfigReg/BBdly] [get_bd_pins NMRPulseSequencer_0/BBdly]
connect_bd_net [get_bd_pins TxConfigReg/Blen] [get_bd_pins NMRPulseSequencer_0/Blen]
connect_bd_net -net NMRPulseSequencer_0_pulse_on [get_bd_pins NMRPulseSequencer_0/pulse_on_out] [get_bd_pins pulse_on]
connect_bd_net [get_bd_pins NMRPulseSequencer_0/start_seq] [get_bd_pins sync]
connect_bd_net -net RxReset_1 [get_bd_pins TxReset] [get_bd_pins NMRPulseSequencer_0/rst]
connect_bd_net [get_bd_pins pulse_on_in] [get_bd_pins NMRPulseSequencer_0/pulse_on_in]
connect_bd_net [get_bd_pins const_3/dout] [get_bd_pins dds_compiler_0/aresetn]
connect_bd_net [get_bd_pins TxConfigReg/PIR] [get_bd_pins axis_constant_0/cfg_data]
connect_bd_net [get_bd_pins NMRPulseSequencer_0/pulse_on_outn] [get_bd_pins axis_zeroer_0/zero]

current_bd_instance /tx_0/TxConfigReg
connect_bd_intf_net [get_bd_intf_pins S_AXI] [get_bd_intf_pins cfg_0/S_AXI]
connect_bd_net -net Din_1 [get_bd_pins cfg_0/cfg_data] \
  [get_bd_pins slice_pir/Din] [get_bd_pins slice_alen/Din] [get_bd_pins slice_blen/Din] [get_bd_pins slice_abdly/Din] \
  [get_bd_pins slice_bbdly/Din] [get_bd_pins slice_bbcnt/Din]
connect_bd_net [get_bd_pins slice_pir/Dout] [get_bd_pins PIR]
connect_bd_net [get_bd_pins aclk] [get_bd_pins cfg_0/aclk]
connect_bd_net -net s_axis_aresetn_1 [get_bd_pins aresetn] [get_bd_pins cfg_0/aresetn]
connect_bd_net [get_bd_pins slice_abdly/Dout] [get_bd_pins ABdly]
connect_bd_net [get_bd_pins slice_alen/Dout] [get_bd_pins Alen]
connect_bd_net [get_bd_pins slice_bbcnt/Dout] [get_bd_pins BBcnt]
connect_bd_net [get_bd_pins slice_bbdly/Dout] [get_bd_pins BBdly]
connect_bd_net [get_bd_pins slice_blen/Dout] [get_bd_pins Blen]

current_bd_instance /PS
connect_bd_intf_net [get_bd_intf_pins ps_0/M_AXI_GP0] [get_bd_intf_pins ps_0_axi_periph/S00_AXI]
connect_bd_intf_net [get_bd_intf_pins DDR] [get_bd_intf_pins ps_0/DDR]
connect_bd_intf_net [get_bd_intf_pins FIXED_IO] [get_bd_intf_pins ps_0/FIXED_IO]
connect_bd_intf_net [get_bd_intf_pins M00_AXI] [get_bd_intf_pins ps_0_axi_periph/M00_AXI]
connect_bd_intf_net [get_bd_intf_pins M01_AXI] [get_bd_intf_pins ps_0_axi_periph/M01_AXI]
connect_bd_intf_net [get_bd_intf_pins M02_AXI] [get_bd_intf_pins ps_0_axi_periph/M02_AXI]
connect_bd_intf_net [get_bd_intf_pins M03_AXI] [get_bd_intf_pins ps_0_axi_periph/M03_AXI]
connect_bd_net [get_bd_pins ps_0/FCLK_RESET0_N] [get_bd_pins rst_0/ext_reset_in]
connect_bd_net [get_bd_pins rst_0/interconnect_aresetn] [get_bd_pins ps_0_axi_periph/ARESETN]
connect_bd_net [get_bd_pins ps_0/FCLK_CLK0] \
  [get_bd_pins FCLK_CLK0] [get_bd_pins ps_0/M_AXI_GP0_ACLK] [get_bd_pins rst_0/slowest_sync_clk] \
  [get_bd_pins ps_0_axi_periph/ACLK] [get_bd_pins ps_0_axi_periph/S00_ACLK] [get_bd_pins ps_0_axi_periph/M00_ACLK] \
  [get_bd_pins ps_0_axi_periph/M01_ACLK] [get_bd_pins ps_0_axi_periph/M02_ACLK] [get_bd_pins ps_0_axi_periph/M03_ACLK]
connect_bd_net [get_bd_pins rst_0/peripheral_aresetn] \
  [get_bd_pins rst_periph] [get_bd_pins ps_0_axi_periph/S00_ARESETN] [get_bd_pins ps_0_axi_periph/M00_ARESETN] \
  [get_bd_pins ps_0_axi_periph/M01_ARESETN] [get_bd_pins ps_0_axi_periph/M02_ARESETN] \
  [get_bd_pins ps_0_axi_periph/M03_ARESETN]

current_bd_instance /RxConfigReg
connect_bd_intf_net [get_bd_intf_pins S_AXI] [get_bd_intf_pins cfg_0/S_AXI]
connect_bd_net [get_bd_pins cfg_0/cfg_data] \
  [get_bd_pins slice_3456/Din] [get_bd_pins slice_12/Din] [get_bd_pins slice_0a/Din] [get_bd_pins slice_0b/Din] \
  [get_bd_pins slice_0b1/Din]
connect_bd_net -net ps_0_FCLK_CLK0 [get_bd_pins aclk] [get_bd_pins cfg_0/aclk]
connect_bd_net -net rst_0_peripheral_aresetn [get_bd_pins aresetn] [get_bd_pins cfg_0/aresetn]
connect_bd_net -net slice_0_Dout [get_bd_pins slice_0b/Dout] [get_bd_pins TxReset]
connect_bd_net -net slice_3_Dout [get_bd_pins slice_0a/Dout] [get_bd_pins RxReset]
connect_bd_net -net slice_4_Dout [get_bd_pins slice_3456/Dout] [get_bd_pins RxPIR]
connect_bd_net -net slice_2_Dout [get_bd_pins slice_12/Dout] [get_bd_pins RxRate]
connect_bd_net [get_bd_pins slice_0b1/Dout] [get_bd_pins TxForceOn]

current_bd_instance /DAC
connect_bd_intf_net [get_bd_intf_pins axis_constant_0/M_AXIS] [get_bd_intf_pins axis_combiner_0/S01_AXIS]
connect_bd_intf_net [get_bd_intf_pins axis_combiner_0/S00_AXIS] [get_bd_intf_pins fifo_0/M_AXIS]
connect_bd_intf_net [get_bd_intf_pins axis_combiner_0/M_AXIS] [get_bd_intf_pins dac_0/S_AXIS]
connect_bd_intf_net [get_bd_intf_pins S_AXIS_DAC0] [get_bd_intf_pins fifo_0/S_AXIS]
connect_bd_net [get_bd_pins pll_0/clk_out1] [get_bd_pins dac_0/ddr_clk]
connect_bd_net [get_bd_pins pll_0/locked] [get_bd_pins dac_0/locked]
connect_bd_net -net adc_0_adc_clk [get_bd_pins clk125] \
  [get_bd_pins dac_0/aclk] [get_bd_pins axis_dwidth_converter_0/aclk] [get_bd_pins axis_combiner_0/aclk] \
  [get_bd_pins axis_constant_0/aclk] [get_bd_pins fifo_0/m_axis_aclk] [get_bd_pins pll_0/clk_in1]
connect_bd_net -net rst_0_peripheral_aresetn [get_bd_pins s_axis_aresetn] [get_bd_pins fifo_0/s_axis_aresetn]
connect_bd_net -net ps_0_FCLK_CLK0 [get_bd_pins s_axis_aclk] [get_bd_pins fifo_0/s_axis_aclk]
connect_bd_net [get_bd_pins xlconstant_1/dout] \
  [get_bd_pins axis_combiner_0/aresetn] [get_bd_pins axis_dwidth_converter_0/aresetn] [get_bd_pins fifo_0/m_axis_aresetn]
connect_bd_net [get_bd_pins dac_0/dac_clk] [get_bd_pins dac_clk]
connect_bd_net [get_bd_pins dac_0/dac_rst] [get_bd_pins dac_rst]
connect_bd_net [get_bd_pins dac_0/dac_sel] [get_bd_pins dac_sel]
connect_bd_net [get_bd_pins dac_0/dac_wrt] [get_bd_pins dac_wrt]
connect_bd_net [get_bd_pins dac_0/dac_dat] [get_bd_pins dac_dat]
connect_bd_net [get_bd_pins xlconstant_0/dout] [get_bd_pins axis_constant_0/cfg_data]

current_bd_instance /ADC
connect_bd_intf_net [get_bd_intf_pins adc_0/M_AXIS] [get_bd_intf_pins axis_subset_converter_0/S_AXIS]
connect_bd_intf_net [get_bd_intf_pins fifo_0/S_AXIS] [get_bd_intf_pins axis_subset_converter_0/M_AXIS]
connect_bd_intf_net [get_bd_intf_pins M_AXIS_ADC0] [get_bd_intf_pins fifo_0/M_AXIS]
connect_bd_net [get_bd_pins const_0/dout] [get_bd_pins fifo_0/s_axis_aresetn] [get_bd_pins axis_subset_converter_0/aresetn]
connect_bd_net [get_bd_pins adc_0/adc_clk] [get_bd_pins clk125] [get_bd_pins fifo_0/s_axis_aclk] [get_bd_pins axis_subset_converter_0/aclk]
connect_bd_net [get_bd_pins adc_0/adc_csn] [get_bd_pins adc_csn]
connect_bd_net -net adc_clk_p_i_1 [get_bd_pins adc_clk_p] [get_bd_pins adc_0/adc_clk_p]
connect_bd_net -net adc_clk_n_i_1 [get_bd_pins adc_clk_n] [get_bd_pins adc_0/adc_clk_n]
connect_bd_net -net adc_dat_a_i_1 [get_bd_pins adc_dat_a] [get_bd_pins adc_0/adc_dat_a]
connect_bd_net -net adc_dat_b_i_1 [get_bd_pins adc_dat_b] [get_bd_pins adc_0/adc_dat_b]
connect_bd_net -net rst_0_peripheral_aresetn [get_bd_pins m_axis_aresetn] [get_bd_pins fifo_0/m_axis_aresetn]
connect_bd_net -net ps_0_FCLK_CLK0 [get_bd_pins m_axis_aclk] [get_bd_pins fifo_0/m_axis_aclk]

current_bd_instance /
connect_bd_intf_net [get_bd_intf_pins PS/M00_AXI] [get_bd_intf_pins RxConfigReg/S_AXI]
connect_bd_intf_net [get_bd_intf_pins PS/M01_AXI] [get_bd_intf_pins sts_0/S_AXI]
connect_bd_intf_net [get_bd_intf_pins PS/M02_AXI] [get_bd_intf_pins rx_0/S_AXI_OUT]
connect_bd_intf_net [get_bd_intf_pins tx_0/S_AXI_CFG] [get_bd_intf_pins PS/M03_AXI]
connect_bd_intf_net [get_bd_intf_pins DAC/S_AXIS_DAC0] [get_bd_intf_pins tx_0/M_AXIS_DAC0]
connect_bd_intf_net [get_bd_intf_pins ADC/M_AXIS_ADC0] [get_bd_intf_pins rx_0/S_AXIS_RF]
connect_bd_intf_net [get_bd_intf_ports DDR] [get_bd_intf_pins PS/DDR]
connect_bd_intf_net [get_bd_intf_ports FIXED_IO] [get_bd_intf_pins PS/FIXED_IO]
connect_bd_net -net ps_0_FCLK_CLK0 [get_bd_pins PS/FCLK_CLK0] \
  [get_bd_pins sts_0/aclk] [get_bd_pins rx_0/aclk] [get_bd_pins tx_0/aclk] [get_bd_pins RxConfigReg/aclk] \
  [get_bd_pins DAC/s_axis_aclk] [get_bd_pins ADC/m_axis_aclk]
connect_bd_net [get_bd_ports adc_clk_p_i] [get_bd_pins ADC/adc_clk_p]
connect_bd_net [get_bd_ports adc_clk_n_i] [get_bd_pins ADC/adc_clk_n]
connect_bd_net [get_bd_ports adc_dat_a_i] [get_bd_pins ADC/adc_dat_a]
connect_bd_net [get_bd_ports adc_dat_b_i] [get_bd_pins ADC/adc_dat_b]
connect_bd_net -net adc_0_adc_csn [get_bd_pins ADC/adc_csn] [get_bd_ports adc_csn_o]
connect_bd_net -net adc_0_adc_clk [get_bd_pins ADC/clk125] [get_bd_pins cntr_0/CLK] [get_bd_pins DAC/clk125]
connect_bd_net [get_bd_pins cntr_0/Q] [get_bd_pins slice_0/Din]
connect_bd_net -net dac_0_dac_clk [get_bd_pins DAC/dac_clk] [get_bd_ports dac_clk_o]
connect_bd_net -net dac_0_dac_rst [get_bd_pins DAC/dac_rst] [get_bd_ports dac_rst_o]
connect_bd_net -net dac_0_dac_sel [get_bd_pins DAC/dac_sel] [get_bd_ports dac_sel_o]
connect_bd_net -net dac_0_dac_wrt [get_bd_pins DAC/dac_wrt] [get_bd_ports dac_wrt_o]
connect_bd_net -net dac_0_dac_dat [get_bd_pins DAC/dac_dat] [get_bd_ports dac_dat_o]
connect_bd_net -net rst_0_peripheral_aresetn [get_bd_pins PS/rst_periph] \
  [get_bd_pins sts_0/aresetn] [get_bd_pins rx_0/aresetn] [get_bd_pins tx_0/s_axis_aresetn] [get_bd_pins RxConfigReg/aresetn] \
  [get_bd_pins DAC/s_axis_aresetn] [get_bd_pins ADC/m_axis_aresetn]
connect_bd_net -net aresetn_1 [get_bd_pins RxConfigReg/TxReset] [get_bd_pins tx_0/TxReset]
connect_bd_net -net srst_1 [get_bd_pins RxConfigReg/RxReset] [get_bd_pins rx_0/RxReset]
connect_bd_net -net RxFTW [get_bd_pins RxConfigReg/RxPIR] [get_bd_pins rx_0/PIR]
connect_bd_net -net cfg_data1_1 [get_bd_pins RxConfigReg/RxRate] [get_bd_pins rx_0/RxRate]
connect_bd_net [get_bd_pins tx_0/pulse_on] [get_bd_ports pulse_on] [get_bd_pins xlconcat_0/In3]
connect_bd_net -net tx_0_start_seq [get_bd_pins tx_0/sync] [get_bd_ports sync] [get_bd_pins xlconcat_0/In2]
connect_bd_net [get_bd_pins xlconcat_0/dout] [get_bd_ports led_o]
connect_bd_net [get_bd_pins slice_0/Dout] [get_bd_pins xlconcat_0/In0] [get_bd_pins xlconcat_0/In1]
connect_bd_net [get_bd_pins xlconstant_0/dout] \
  [get_bd_pins xlconcat_0/In4] [get_bd_pins xlconcat_0/In5] [get_bd_pins xlconcat_0/In6] [get_bd_pins xlconcat_0/In7]
connect_bd_net [get_bd_pins RxConfigReg/TxForceOn] [get_bd_pins tx_0/pulse_on_in]
connect_bd_net [get_bd_pins rx_0/rd_data_count] [get_bd_pins xlconcat_1/In0]
connect_bd_net [get_bd_pins xlconcat_1/dout] [get_bd_pins sts_0/sts_data]
connect_bd_net [get_bd_pins xlconstant_2/dout] [get_bd_pins xlconcat_1/In1]

# ---- address map ----
assign_bd_address -offset 0x40000000 -range 4K -target_address_space [get_bd_addr_spaces PS/ps_0/Data] [get_bd_addr_segs RxConfigReg/cfg_0/s_axi/reg0]
assign_bd_address -offset 0x40001000 -range 4K -target_address_space [get_bd_addr_spaces PS/ps_0/Data] [get_bd_addr_segs sts_0/s_axi/reg0]
assign_bd_address -offset 0x40002000 -range 4K -target_address_space [get_bd_addr_spaces PS/ps_0/Data] [get_bd_addr_segs tx_0/TxConfigReg/cfg_0/s_axi/reg0]
assign_bd_address -offset 0x40010000 -range 64K -target_address_space [get_bd_addr_spaces PS/ps_0/Data] [get_bd_addr_segs rx_0/reader_0/s_axi/reg0]

validate_bd_design
save_bd_design
